# Altium schematic sheet UART.SchDoc
size A4; DocumentNumber: 19; SheetNumber: ALT0056; SheetTotal: 21
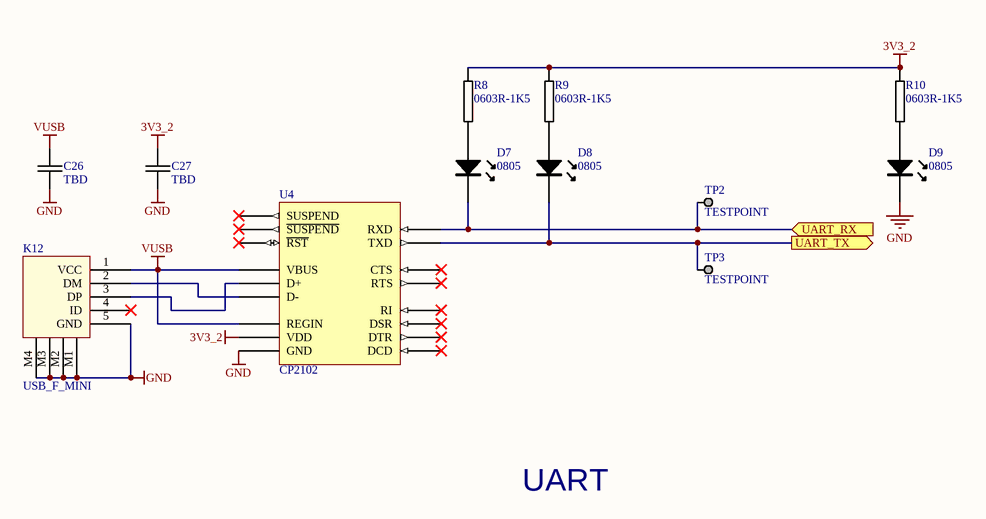
[diagram p0: UART.SchDoc]

## Parts
C26  TBD  [1210C-GENERIC]
C27  TBD  [1210C-GENERIC]
D7  0805  [0805LED]
D8  0805  [0805LED]
D9  0805  [0805LED]
K12  USB_F_MINI  [USB_F_MINI]
R8  0603R-1K5  [0603R-1k5]
R9  0603R-1K5  [0603R-1k5]
R10  0603R-1K5  [0603R-1k5]
TP2  TESTPOINT  [TESTPOINT]
TP3  TESTPOINT  [TESTPOINT]
U4  CP2102  [QFN-28]

## Ports
UART_RX (in), UART_TX (out)

## Nets
3V3_2: C27.1 R8.1 R9.1 R10.1 U4.6(VDD)
GND: C26.2 C27.2 D9.K K12.5(GND) K12.M1 K12.M2 K12.M3 K12.M4 U4.3(GND)
VUSB: C26.1 K12.1(VCC) U4.7(REGIN) U4.8(VBUS)
UART_RX: D7.K TP2.1 U4.25(RXD) ; port UART_RX
UART_TX: D8.K TP3.1 U4.26(TXD) ; port UART_TX
NetD7_A: D7.A R8.2
NetD8_A: D8.A R9.2
NetD9_A: D9.A R10.2
NetK12_2: K12.2(DM) U4.5(D-)
NetK12_3: K12.3(DP) U4.4(D+)

Not connected (* = marked no-connect by the designer): K12 4(ID)*; U4 1(DCD)* 2(RI)* 9(~{RST})* 11(~{SUSPEND})* 12(SUSPEND)* 23(CTS)* 24(RTS)* 27(DSR)* 28(DTR)*

## Notes on the sheet
- UART
- Title
- Size:
- Date:
- A4
- Number:
- Time:
- Revision:
- Sheet
- of
- File:

## Library data of the parts
C26 C27 = Passives_Capacitors_1210_1210C-TBD: CAPACITOR 1210 CERAMIC VALUE TO BE DETERMINED
D7-D9 = 0805_LED
K12 = USB_F_MINI: MINI USB B FEMALE
R8-R10 = 0603R-1K5: GENERIC RESISTOR 0603; Manufacturer Part Number: RMCF 1/16 15K 1% R; Manufacturer: Stackpole Electronics Inc; Tolerance: ±1%; Resistance In Ohms: 15.0K; Power (Watts): 0.1W, 1/10W; Temperature Coefficient: ±100ppm/°C; Supplier 1: Digi-Key; Supplier Part Number 1: RMCF1/1615KFRTR-ND; Supplier: Digi-Key; Supplier Part Number: RMCF1/1615KFRTR-ND; Packaging: Tape & Reel (TR); Category: Resistors; Case: 0603 (1608 metric); Composition: Thick Film; Lead Style: Surface Mount (SMD - SMT); RoHS: RoHS Compliant
TP2 TP3 = TESTPOINT: TESTPOINT SCOPE GRABBER; Manufacturer Part Number: 5010; Manufacturer: Keystone Electronics; Reel: TH; Supplier 1: Digi-Key; Supplier Part Number 1: 5010K-ND